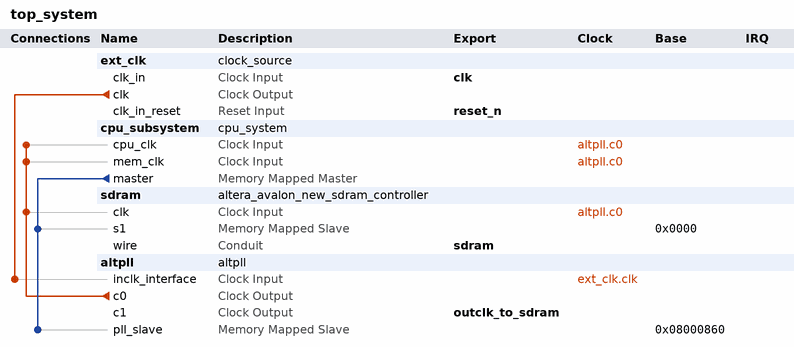
[diagram p0: system contents]
# Platform Designer (Qsys) system top_system
# Parameters at their usual value, and those the tool derives, are not listed.
package require -exact qsys 10.1
create_system top_system
set_project_property DEVICE_FAMILY CYCLONEIVE

add_instance ext_clk clock_source 10.1
set_instance_parameter_value ext_clk clockFrequency 100000000

add_instance cpu_subsystem cpu_system 1.0

add_instance sdram altera_avalon_new_sdram_controller 10.1
set_instance_parameter_value sdram TAC 5.5
set_instance_parameter_value sdram TRCD 20.0
set_instance_parameter_value sdram TRP 20.0
set_instance_parameter_value sdram casLatency 3
set_instance_parameter_value sdram columnWidth 10
set_instance_parameter_value sdram dataWidth 32
set_instance_parameter_value sdram generateSimulationModel false
set_instance_parameter_value sdram model custom
set_instance_parameter_value sdram numberOfBanks 4
set_instance_parameter_value sdram numberOfChipSelects 1
set_instance_parameter_value sdram powerUpDelay 100.0
set_instance_parameter_value sdram refreshPeriod 15.625
set_instance_parameter_value sdram rowWidth 13

add_instance altpll altpll 10.1
set_instance_parameter_value altpll INCLK0_INPUT_FREQUENCY 10000
set_instance_parameter_value altpll CLK0_MULTIPLY_BY 1
set_instance_parameter_value altpll CLK1_MULTIPLY_BY 1
set_instance_parameter_value altpll CLK0_DIVIDE_BY 1
set_instance_parameter_value altpll CLK1_DIVIDE_BY 1
set_instance_parameter_value altpll CLK1_PHASE_SHIFT -2500
set_instance_parameter_value altpll CLK1_DUTY_CYCLE 50
set_instance_parameter_value altpll PORT_clk1 PORT_USED
set_instance_parameter_value altpll PORT_clk2 PORT_UNUSED
set_instance_parameter_value altpll PORT_clk3 PORT_UNUSED
set_instance_parameter_value altpll PORT_ARESET PORT_UNUSED
set_instance_parameter_value altpll PORT_LOCKED PORT_UNUSED

# connections
add_connection altpll.c0 cpu_subsystem.cpu_clk clock
add_connection altpll.c0 cpu_subsystem.mem_clk clock
add_connection altpll.c0 sdram.clk clock
add_connection ext_clk.clk altpll.inclk_interface clock
add_connection cpu_subsystem.master altpll.pll_slave avalon
set_connection_parameter_value cpu_subsystem.master/altpll.pll_slave baseAddress 0x08000860
add_connection cpu_subsystem.master sdram.s1 avalon
set_connection_parameter_value cpu_subsystem.master/sdram.s1 baseAddress 0x0000

# exported interfaces
add_interface clk clock sink
set_interface_property clk EXPORT_OF ext_clk.clk_in
add_interface reset_n reset sink
set_interface_property reset_n EXPORT_OF ext_clk.clk_in_reset
add_interface sdram conduit end
set_interface_property sdram EXPORT_OF sdram.wire
add_interface outclk_to_sdram clock source
set_interface_property outclk_to_sdram EXPORT_OF altpll.c1

save_system top_system.qsys
